# EAGLE design v002 (EAGLE 6.4)
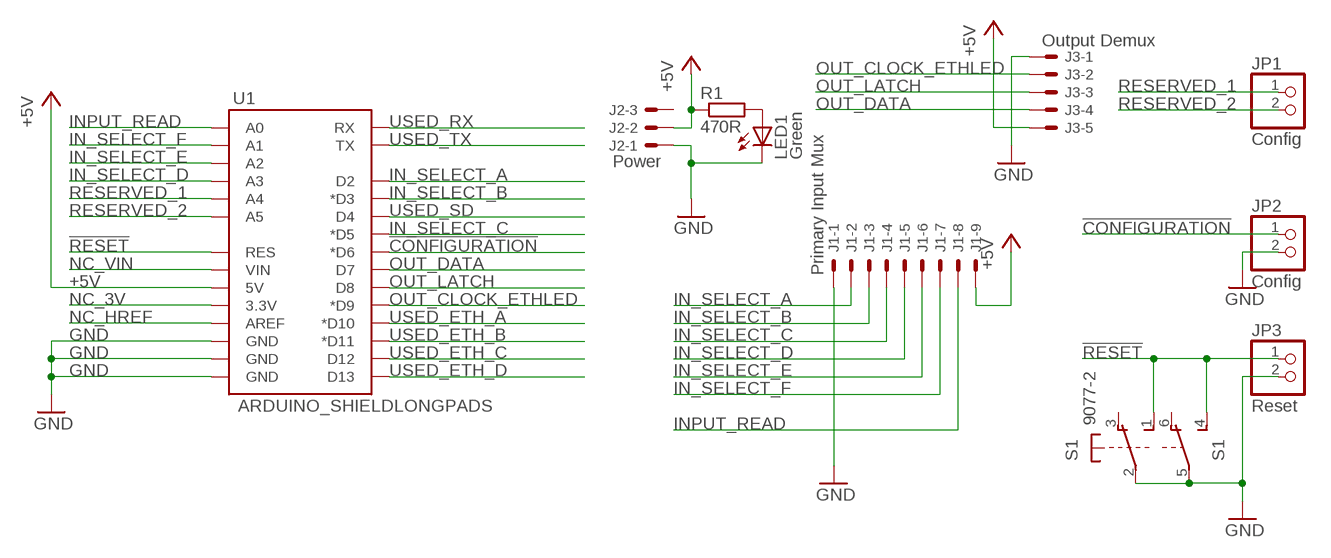
[diagram p0: schematic, sheet 1]

## Parts
J1  Primary Input Mux  22-27-2091-09  [6410-09]
J2  Power  22-27-2031-03  [6410-03]
J3  Output Demux  22-27-2051-05  [6410-05]
JP1  Config  PINHD-1X2  [1X02]
JP2  Config  PINHD-1X2  [1X02]
JP3  Reset  PINHD-1X2  [1X02]
LED1  Green  LED3MM  [LED3MM]
R1  470R  R-EU_0204/7  [0204/7]
S1  9077-2  [9077-2]
U1  ARDUINO_SHIELDLONGPADS  [DUEMILANOVE_SHIELD_LONGPADS]

## Nets
!CONFIGURATION: JP2.1 U1.D6(*D6)
!RESET: JP3.1 S1.1(1:S) S1.4(2:S) U1.RES
+5V: J1.9 J2.2 J3.5 R1.1 U1.5V
GND: J1.1 J2.1 J3.1 JP2.2 JP3.2 LED1.K(C) S1.2(1:P) S1.5(2:P) U1.GND@0(GND) U1.GND@1(GND) U1.GND@2(GND)
IN_SELECT_A: J1.2 U1.D2
IN_SELECT_B: J1.3 U1.D3(*D3)
IN_SELECT_C: J1.4 U1.D5(*D5)
IN_SELECT_D: J1.5 U1.A3
IN_SELECT_E: J1.6 U1.A2
IN_SELECT_F: J1.7 U1.A1
INPUT_READ: J1.8 U1.A0
N$1: LED1.A R1.2
NC_3V: U1.3.3V
NC_HREF: U1.AREF
NC_VIN: U1.VIN
OUT_CLOCK_ETHLED: J3.2 U1.D9(*D9)
OUT_DATA: J3.4 U1.D7
OUT_LATCH: J3.3 U1.D8
RESERVED_1: JP1.1 U1.A4
RESERVED_2: JP1.2 U1.A5
USED_ETH_A: U1.D10(*D10)
USED_ETH_B: U1.D11(*D11)
USED_ETH_C: U1.D12
USED_ETH_D: U1.D13
USED_RX: U1.RX
USED_SD: U1.D4
USED_TX: U1.TX
Unconnected: J2.3 S1.3(1:O) S1.6(2:O)

## Library data of the parts
J1 = con-molex:22-?-09: CONNECTOR wire to board 2.54 mm (.1 inch) pitch header; OC_FARNELL: unknown; OC_NEWARK: unknown
J2 = con-molex:22-?-03: CONNECTOR wire to board 2.54 mm (.1 inch) pitch header; OC_FARNELL: unknown; OC_NEWARK: unknown
J3 = con-molex:22-?-05: CONNECTOR wire to board 2.54 mm (.1 inch) pitch header; OC_FARNELL: unknown; OC_NEWARK: unknown
JP1-JP3 = pinhead:PINHD-1X2: PIN HEADER
LED1 = led:LED: LED OSRAM: - CHIPLED LG R971, LG N971, LY N971, LG Q971, LY Q971, LO R971, LY R971 LH N974, LH R974 LS Q976, LO Q976, LY Q976 LO Q996 - Hyper CHIPLED LW Q18S LB Q993, LB Q99A, LB R99A - SideLED LS A670, LO A670, LY A670, LG A670, LP A670 LB A673, LV A673, LT A673, LW A673 LH A674 LY A675 LS A676, LA A676, LO A676, LY A676, LW A676 LS A679, LY A679, LG A679 - Hyper Micro SIDELED® LS Y876, LA Y876, LO Y876, LY Y876 LT Y87S - SmartLED LW L88C, LW L88S LB L89C, LB L89S, LG L890 LS L89K, LO L89K, LY L89K LS L896, LA L896, LO L896, LY L896 - TOPLED LS T670, LO T670, LY T670, LG T670, LP T670 LSG T670, LSP T670, LSY T670, LOP T670, LYG T670 LG T671, LOG T671, LSG T671 LB T673, LV T673, LT T673, LW T673 LH T674 LS T676, LA T676, LO T676, LY T676, LB T676, LH T676, LSB T676, LW T676 LB T67C, LV T67C, LT T67C, LS T67K, LO T67K, LY T67K, LW E67C LS E67B, LA E67B, LO E67B, LY E67B, LB E67C, LV E67C, LT E67C LW T67C LS T679, LY T679, LG T679 LS T770, LO T770, LY T770, LG T770, LP T770 LB T773, LV T773, LT T773, LW T773 LH T774 LS E675, LA E675, LY E675, LS T675 LS T776, LA T776, LO T776, LY T776, LB T776 LHGB T686 LT T68C, LB T68C - Hyper Mini TOPLED® LB M676 - Mini TOPLED Santana® LG M470 LS M47K, LO M47K, LY M47K Source: http://www.osram.convergy.de LUXEON: - LUMILED® LXK2-PW12-R00, LXK2-PW12-S00, LXK2-PW14-U00, LXK2-PW14-V00 LXK2-PM12-R00, LXK2-PM12-S00, LXK2-PM14-U00 LXK2-PE12-Q00, LXK2-PE12-R00, LXK2-PE12-S00, LXK2-PE14-T00, LXK2-PE14-U00 LXK2-PB12-K00, LXK2-PB12-L00, LXK2-PB12-M00, LXK2-PB14-N00, LXK2-PB14-P00, LXK2-PB14-Q00 LXK2-PR12-L00, LXK2-PR12-M00, LXK2-PR14-Q00, LXK2-PR14-R00 LXK2-PD12-Q00, LXK2-PD12-R00, LXK2-PD12-S00 LXK2-PH12-R00, LXK2-PH12-S00 LXK2-PL12-P00, LXK2-PL12-Q00, LXK2-PL12-R00 Source: www.luxeon.com KINGBRIGHT: KA-3528ASYC Source: www.kingbright.com
R1 = rcl:R-EU_: RESISTOR, European symbol
S1 = switch-misc:9077-2: MARQUARDT SWITCH 9077.0200 Distributor: Buerklin <https://www.buerklin.com/default.asp?event=ShowArtikel%2812G2822%29&l=d&jump=ArtNr_12G2822>
U1 = SparkFun-Boards:ARDUINO_SHIELD: Arduino shield footprint

## Board
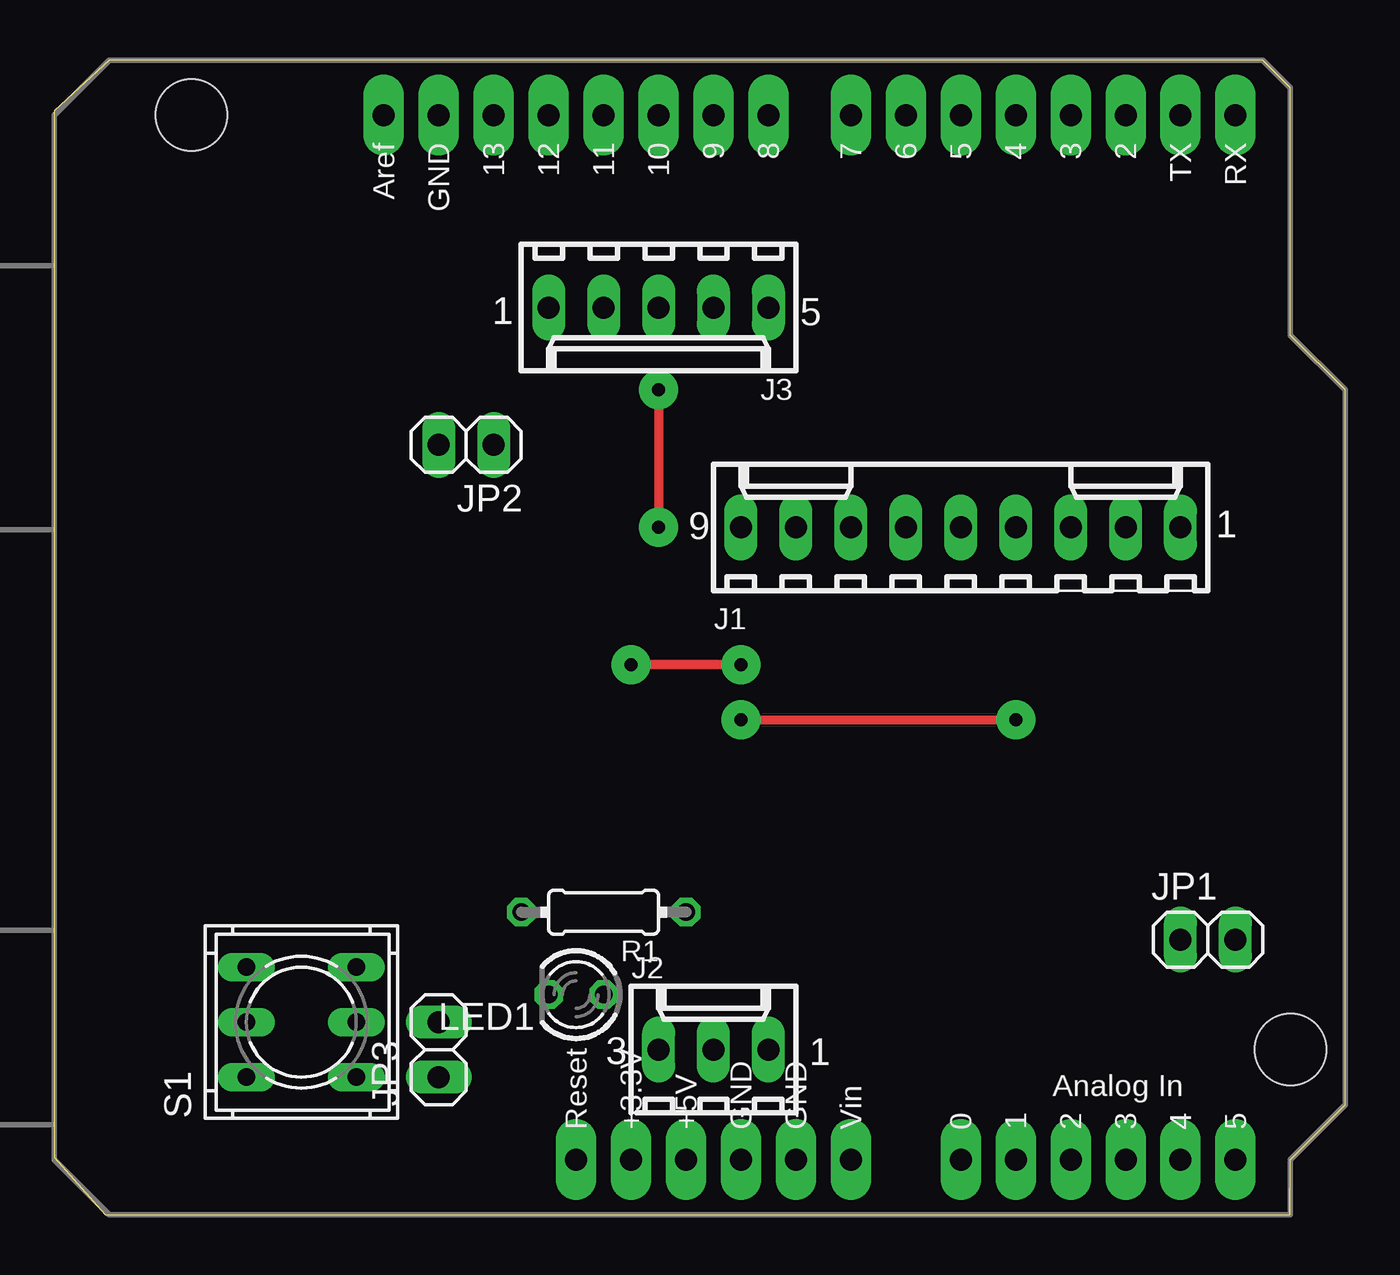
[diagram p1: board, top side]
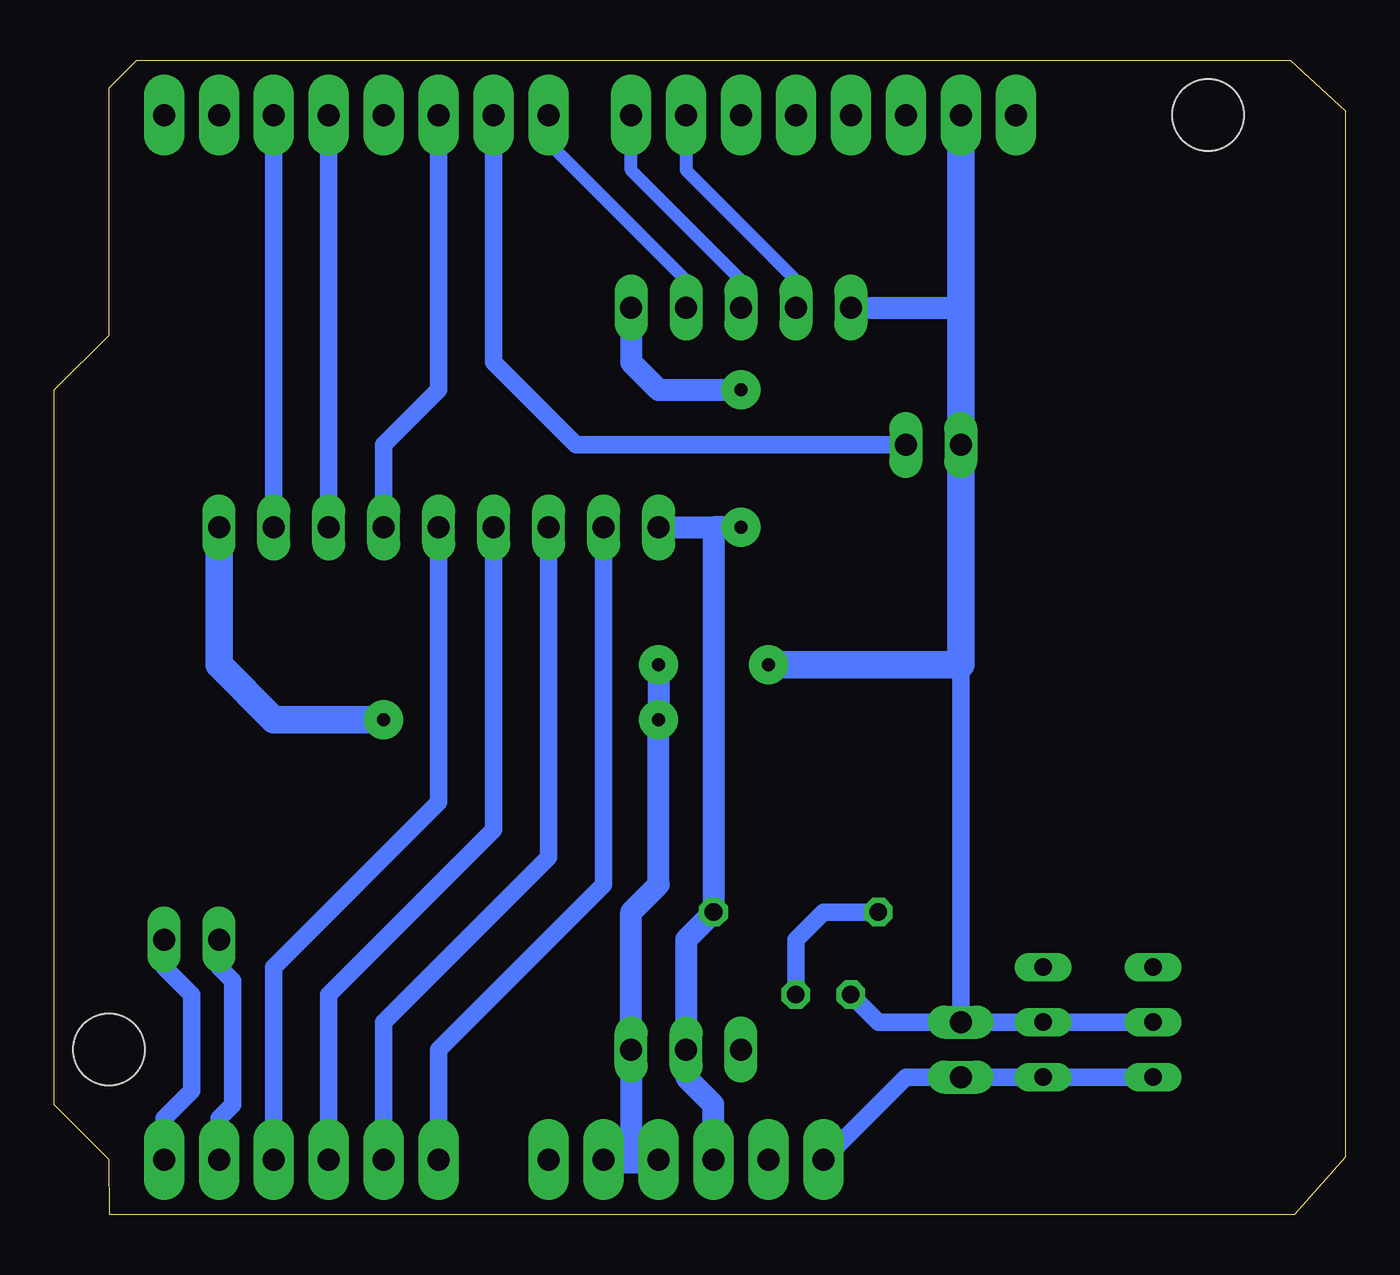
[diagram p2: board, bottom side, seen from below]

Size 59.69 x 53.34 mm. Coordinates in mm from the lower left corner, seen from the top.
Outline: 2.37,0 57.13,0 57.15,2.54 59.69,5.08 59.69,38.1 57.15,40.64 57.15,52.07 55.88,53.34 2.54,53.34 0,51 0,2.63 2.37,0
Copper layers (1*16): Top 0.035mm / dielectric 1.5mm / Bottom 0.035mm
Design rules "default": minimum track width 10mil, minimum drill 24mil, track to track 8mil, track to pad 8mil, pad to pad 8mil, via to via 8mil, smd to smd 8mil, copper to edge 40mil, drill to drill 8mil, minimum pad ring 10mil, minimum via ring 8mil, stop-mask expansion 4mil, vias tented up to drill 0mil, thermal gap 10mil

### Footprints (pad centres in the part's own frame; a part is rotated, then mirrored left to right if it is on the bottom)
6410-09 = drill 1.016 long: 1 10.16,0; 2 7.62,0; 3 5.08,0; 4 2.54,0; 5 0,0; 6 -2.54,0; 7 -5.08,0; 8 -7.62,0; 9 -10.16,0
6410-03 = drill 1.016 long: 1 2.54,0; 2 0,0; 3 -2.54,0
6410-05 = drill 1.016 long: 1 5.08,0; 2 2.54,0; 3 0,0; 4 -2.54,0; 5 -5.08,0
1X02 = drill 1.016 long: 1 -1.27,0; 2 1.27,0
LED3MM = drill 0.813 octagon: A -1.27,0; K 1.27,0
0204/7 = drill 0.813 octagon: 1 -3.81,0; 2 3.81,0
9077-2 = drill 0.813 long: 1 -2.54,2.54; 2 0,2.54; 3 2.54,2.54; 4 -2.54,-2.54; 5 0,-2.54; 6 2.54,-2.54
DUEMILANOVE_SHIELD_LONGPADS = drill 1.016 pad 1.88 long: 3.3V 50.8,26.67; 5V 50.8,29.21; A0 50.8,41.91; A1 50.8,44.45; A2 50.8,46.99; A3 50.8,49.53; A4 50.8,52.07; A5 50.8,54.61; AREF 2.54,15.24; D2 2.54,49.53; D3 2.54,46.99; D4 2.54,44.45; D5 2.54,41.91; D6 2.54,39.37; D7 2.54,36.83; D8 2.54,33.02; D9 2.54,30.48; D10 2.54,27.94; D11 2.54,25.4; D12 2.54,22.86; D13 2.54,20.32; GND@0 50.8,31.75; GND@1 50.8,34.29; GND@2 2.54,17.78; RES 50.8,24.13; RX 2.54,54.61; TX 2.54,52.07; VIN 50.8,36.83 | hole 3.302: 45.72,57.15; 2.54,6.35

### Placement (x,y rotation side)
J1  41.91,31.75 0 top
J2  30.48,7.62 0 top
J3  27.94,41.91 180 top
JP1  53.34,12.7 0 top
JP2  19.05,35.56 180 top
JP3  17.78,7.62 90 top
LED1  24.13,10.16 180 top
R1  25.4,13.97 180 top
S1  11.43,8.89 90 top
U1  0,53.34 270 top

### Tracks (layer width: path | path; a pad name or v marks a point on that pad's centre or on a via)
!CONFIGURATION
  Bottom 0.813: U1.D6 39.37,39.37 35.56,35.56 JP2.1
!RESET
  Bottom 0.813: U1.RES 20.32,6.35 JP3.1 S1.4 S1.1
+5V  (via drill 0.6 pad 1.8)
  Top 0.406: v27.94,38.1 v27.94,31.75
  Bottom 1.016: J1.9 29.21,31.75 | 29.21,31.75 R1.1 30.48,12.7 J2.2 30.48,6.35 29.21,5.08 U1.5V | J3.5 33.02,39.37 31.75,38.1 v27.94,38.1 | v27.94,31.75 29.21,31.75
GND  (via drill 0.6 pad 1.8)
  Top 0.406: v31.75,22.86 v44.45,22.86 | v31.75,25.4 v26.67,25.4
  Bottom 0.813: S1.2 S1.5 JP3.2 | LED1.K 21.59,8.89 JP3.2 | 17.78,25.4 JP3.2
  Bottom 1.016: 33.02,2.54 J2.1 33.02,13.97 31.75,15.24 v31.75,22.86 v31.75,25.4 | J3.1 17.78,41.91
  Bottom 1.27: v44.45,22.86 49.53,22.86 52.07,25.4 J1.1 | U1.GND@2 17.78,41.91 JP2.2 17.78,25.4 v26.67,25.4 | U1.GND@1 33.02,2.54 U1.GND@0
IN_SELECT_A
  Bottom 0.813: U1.D2 J1.2
IN_SELECT_B
  Bottom 0.813: J1.3 U1.D3
IN_SELECT_C
  Bottom 0.813: U1.D5 41.91,38.1 44.45,35.56 J1.4
IN_SELECT_D
  Bottom 0.813: J1.5 41.91,19.05 49.53,11.43 U1.A3
IN_SELECT_E
  Bottom 0.813: J1.6 39.37,17.78 46.99,10.16 U1.A2
IN_SELECT_F
  Bottom 0.813: J1.7 36.83,16.51 44.45,8.89 U1.A1
INPUT_READ
  Bottom 0.813: J1.8 34.29,15.24 41.91,7.62 U1.A0
N$1
  Bottom 0.813: R1.2 24.13,13.97 25.4,12.7 LED1.A
OUT_CLOCK_ETHLED
  Bottom 0.61: U1.D9 30.48,48.26 25.4,43.18 J3.2
OUT_DATA
  Bottom 0.61: J3.4 30.48,43.18 36.83,49.53 U1.D7
OUT_LATCH
  Bottom 0.61: J3.3 27.94,43.18 33.02,48.26 U1.D8
RESERVED_1
  Bottom 0.813: JP1.1 52.07,11.43 51.44,10.79 51.44,5.08 52.07,4.45 U1.A4
RESERVED_2
  Bottom 0.813: U1.A5 54.61,4.45 53.34,5.71 53.34,10.16 54.61,11.43 JP1.2